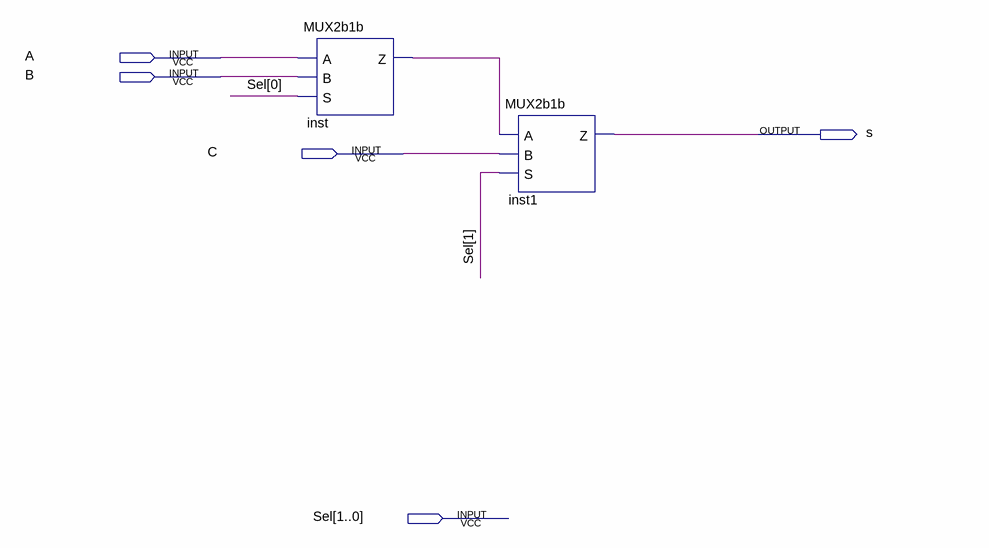
[diagram p0: schematic sheet]
// Quartus schematic MUX3b1b.bdf as structural Verilog: 2 symbols, 5 pins
module MUX3b1b (
  input  A,
  input  B,
  input  C,
  input  [1:0] Sel,
  output s
);

  wire inst_z;

  MUX2b1b inst (.A(A), .B(B), .S(Sel[0]), .Z(inst_z));
  MUX2b1b inst1 (.A(inst_z), .B(C), .S(Sel[1]), .Z(s));
endmodule
